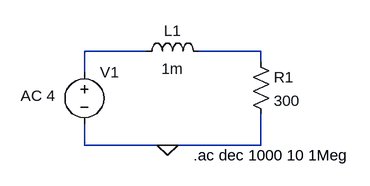
[diagram p0: schematic Exp3part1.asc]
Exp3part1.asc, the LTspice schematic file:
Version 4
SHEET 1 880 680
WIRE 0 80 -96 80
WIRE 176 80 80 80
WIRE 176 96 176 80
WIRE -96 112 -96 80
WIRE -96 224 -96 192
WIRE 32 224 -96 224
WIRE 176 224 176 176
WIRE 176 224 32 224
FLAG 32 224 0
SYMBOL res 160 80 R0
SYMATTR InstName R1
SYMATTR Value 300
SYMBOL ind -16 96 R270
WINDOW 0 32 56 VTop 2
WINDOW 3 5 56 VBottom 2
SYMATTR InstName L1
SYMATTR Value 1m
SYMBOL voltage -96 96 R0
WINDOW 123 -98 52 Left 2
WINDOW 39 0 0 Left 0
SYMATTR InstName V1
SYMATTR Value ""
SYMATTR Value2 AC 4
TEXT 72 240 Left 2 !.ac dec 1000 10 1Meg

The netlist it stands for:
* Exp3part1.asc
R1 N002 0 300
L1 N001 N002 1m
V1 N001 0 AC 4
.ac dec 1000 10 1Meg
.backanno
.end